# EAGLE design ECE445_Interrogator_Schematic (EAGLE 7.5.0)
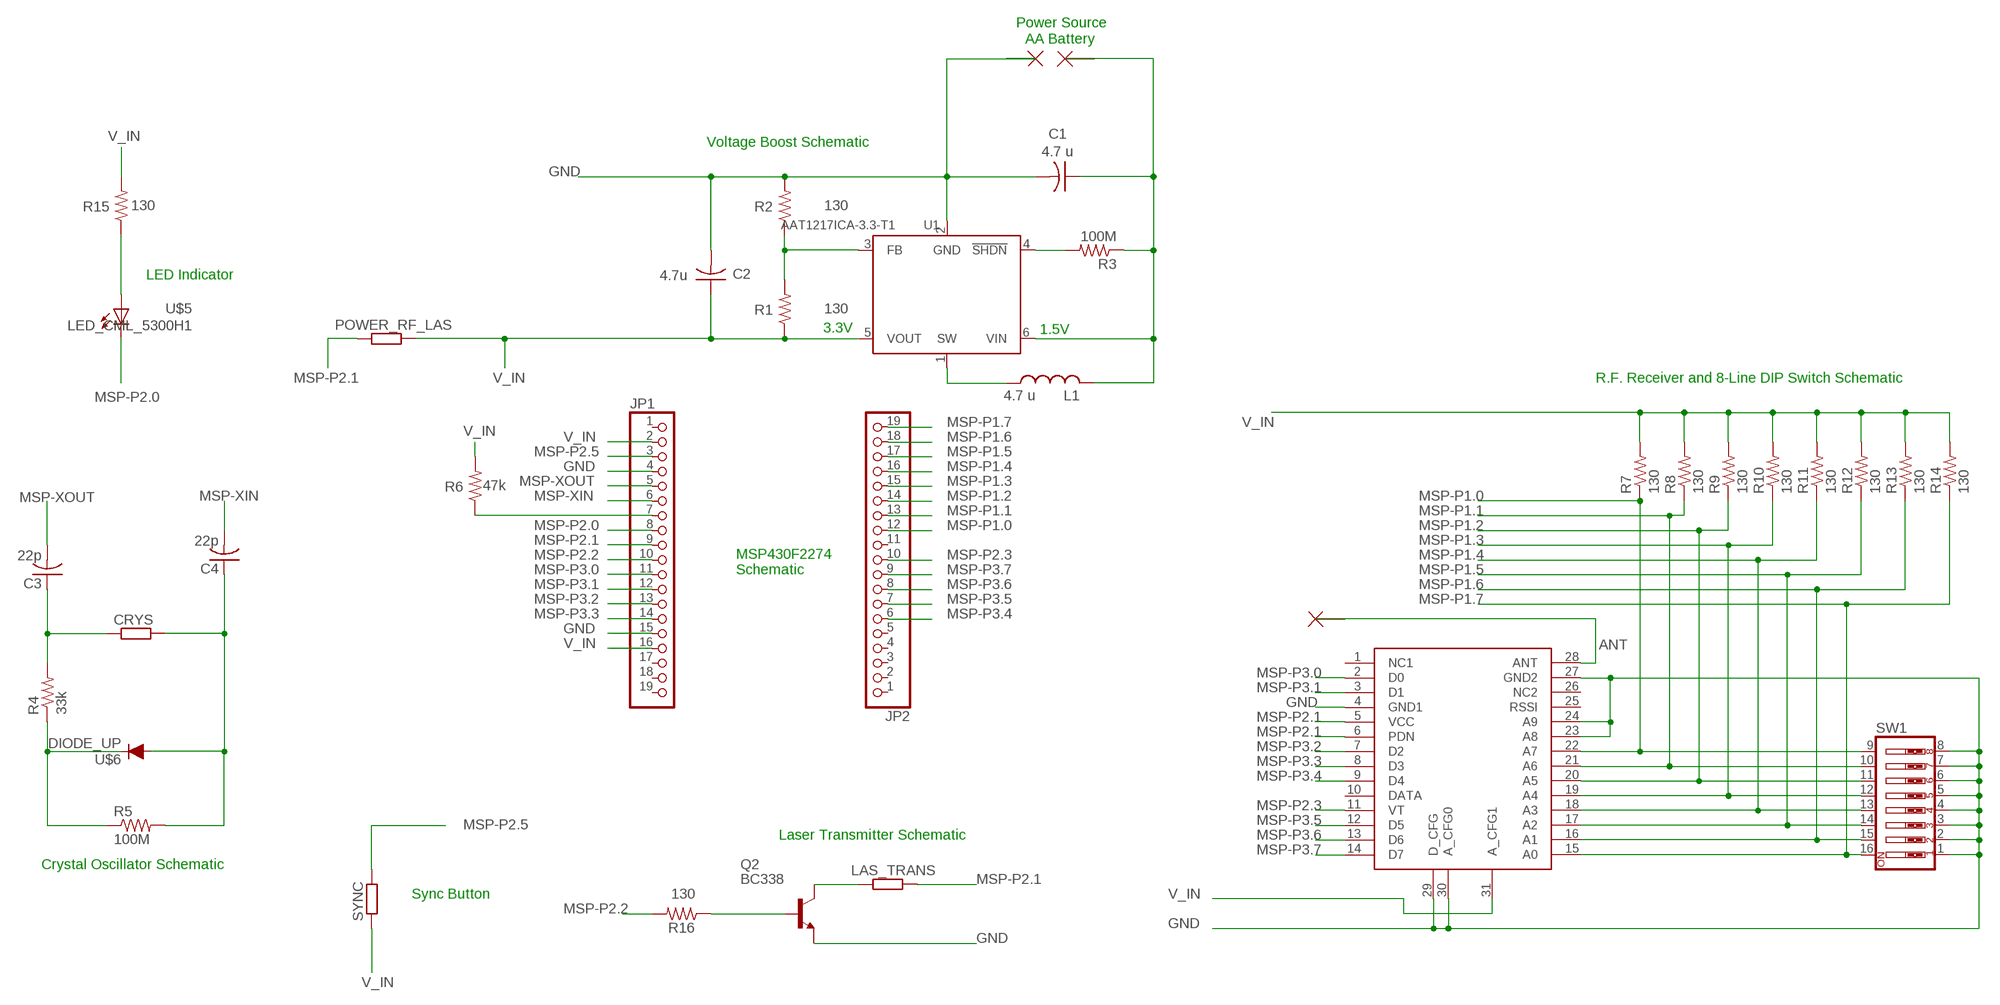
[diagram p0: schematic, sheet 1]

## Parts
C1  4.7 u  C-US025-024X044  [C025-024X044]
C2  4.7u  C-US025-024X044  [C025-024X044]
C3  22p  C-US025-024X044  [C025-024X044]
C4  22p  C-US025-024X044  [C025-024X044]
CRYS  R-EU_0204/5  [0204/5]
JP1  PINHD-1X19  [1X19]
JP2  PINHD-1X19  [1X19]
L1  4.7 u  L-US0204/5  [0204/5]
LAS_TRANS  R-EU_0204/5  [0204/5]
POWER_RF_LAS  R-EU_0204/5  [0204/5]
Q2  BC338  [TO92-EBC]
R1  130  R-US_0204/5  [0204/5]
R2  130  R-US_0204/5  [0204/5]
R3  100M  R-US_0204/2V  [0204V]
R4  33k  R-US_0204/2V  [0204V]
R5  100M  R-US_0204/2V  [0204V]
R6  47k  R-US_0204/5  [0204/5]
R7  130  R-US_0204/5  [0204/5]
R8  130  R-US_0204/5  [0204/5]
R9  130  R-US_0204/5  [0204/5]
R10  130  R-US_0204/5  [0204/5]
R11  130  R-US_0204/5  [0204/5]
R12  130  R-US_0204/5  [0204/5]
R13  130  R-US_0204/5  [0204/5]
R14  130  R-US_0204/5  [0204/5]
R15  130  R-US_0204/5  [0204/5]
R16  130  R-US_0204/5  [0204/5]
SW1  SW_DIP-8  [EDG-08]
SYNC  R-EU_0204/5  [0204/5]
U1  AAT1217ICA-3.3-T1  [TSOT-23-6]
U$1  KH3-RXM-LINX-315  [KH3-RXM-LINX-315]
U$2  NO_CONNECT  [NO_CONNECT]
U$3  NO_CONNECT  [NO_CONNECT]
U$4  NO_CONNECT  [NO_CONNECT]
U$5  LED_CML_5300H1  [LED_CML_5300H1]
U$6  DIODE_UP  [DIODEUP]

## Nets
ANT: U$1.28(ANT) U$4.P$1(NC)
GND: C1.2 C2.2 JP1.4 JP1.15 Q2.E R2.2 SW1.1 SW1.2 SW1.3 SW1.4 SW1.5 SW1.6 SW1.7 SW1.8 U1.2(GND) U$1.4(GND1) U$1.23(A8) U$1.24(A9) U$1.27(GND2) U$1.29(D_CFG) U$1.30(A_CFG0) U$2.P$1(NC)
MSP-P1.0: JP2.12 R7.1 SW1.9 U$1.22(A7)
MSP-P1.1: JP2.13 R8.1 SW1.10 U$1.21(A6)
MSP-P1.2: JP2.14 R9.1 SW1.11 U$1.20(A5)
MSP-P1.3: JP2.15 R10.1 SW1.12 U$1.19(A4)
MSP-P1.4: JP2.16 R11.1 SW1.13 U$1.18(A3)
MSP-P1.5: JP2.17 R12.1 SW1.14 U$1.17(A2)
MSP-P1.6: JP2.18 R13.1 SW1.15 U$1.16(A1)
MSP-P1.7: JP2.19 R14.1 SW1.16 U$1.15(A0)
MSP-P2.0: JP1.8 U$5.P$2(C)
MSP-P2.1: JP1.9 LAS_TRANS.2 POWER_RF_LAS.1 U$1.5(VCC) U$1.6(PDN)
MSP-P2.2: JP1.10 R16.2
MSP-P2.3: JP2.10 U$1.11(VT)
MSP-P2.5: JP1.3 SYNC.2
MSP-P3.0: JP1.11 U$1.2(D0)
MSP-P3.1: JP1.12 U$1.3(D1)
MSP-P3.2: JP1.13 U$1.7(D2)
MSP-P3.3: JP1.14 U$1.8(D3)
MSP-P3.4: JP2.6 U$1.9(D4)
MSP-P3.5: JP2.7 U$1.12(D5)
MSP-P3.6: JP2.8 U$1.13(D6)
MSP-P3.7: JP2.9 U$1.14(D7)
MSP-XIN: C4.2 JP1.6
MSP-XOUT: C3.2 JP1.5
N$1: LAS_TRANS.1 Q2.C
N$2: L1.1 U1.1(SW)
N$4: C1.1 L1.2 R3.1 U1.6(VIN) U$3.P$1(NC)
N$6: C3.1 CRYS.1 R4.2
N$7: Q2.B R16.1
N$8: R4.1 R5.1 U$6.C
N$11: R1.2 R2.1 U1.3(FB)
N$12: C4.1 CRYS.2 R5.2 U$6.A
N$13: JP1.7 R6.1
N$19: R3.2 U1.4(!SHDN)
N$31: R15.1 U$5.P$1(A)
V_IN: C2.1 JP1.2 JP1.16 POWER_RF_LAS.2 R1.1 R6.2 R7.2 R8.2 R9.2 R10.2 R11.2 R12.2 R13.2 R14.2 R15.2 SYNC.1 U1.5(VOUT) U$1.31(A_CFG1)
Unconnected: JP1.1 JP1.17 JP1.18 JP1.19 JP2.1 JP2.2 JP2.3 JP2.4 JP2.5 JP2.11 U$1.1(NC1) U$1.10(DATA) U$1.25(RSSI) U$1.26(NC2)

## Notes on the sheet
- Power Source
- AA Battery
- Voltage Boost Schematic
- LED Indicator
- 3.3V | 1.5V
- R.F. Receiver and 8-Line DIP Switch Schematic
- MSP430F2274
  Schematic
- Laser Transmitter Schematic
- Crystal Oscillator Schematic
- Sync Button

## Library data of the parts
C1-C4 = rcl:C-US: CAPACITOR, American symbol
CRYS LAS_TRANS POWER_RF_LAS SYNC = rcl:R-EU_: RESISTOR, European symbol
JP1 JP2 = pinhead:PINHD-1X19: PIN HEADER
L1 = rcl:L-US: INDUCTOR, American symbol
Q2 = MarkSmartsPartsSpring2015:BC338*: NPN Transistor
R1-R16 = rcl:R-US_: RESISTOR, American symbol
SW1 = special:SW_DIP-8: DIP SWITCH
U1 = Skyworks:AAT1217
U$1 = KH3-RXM-LINX-315:KH3-RXM-LINX-315
U$2-U$4 = NO_CONNECT:NO_CONNECT
U$5 = MarkSmartsPartsSpring2015:LED_CML_5300H1
U$6 = MarkSmartsPartsSpring2015:DIODE_UP

## Board
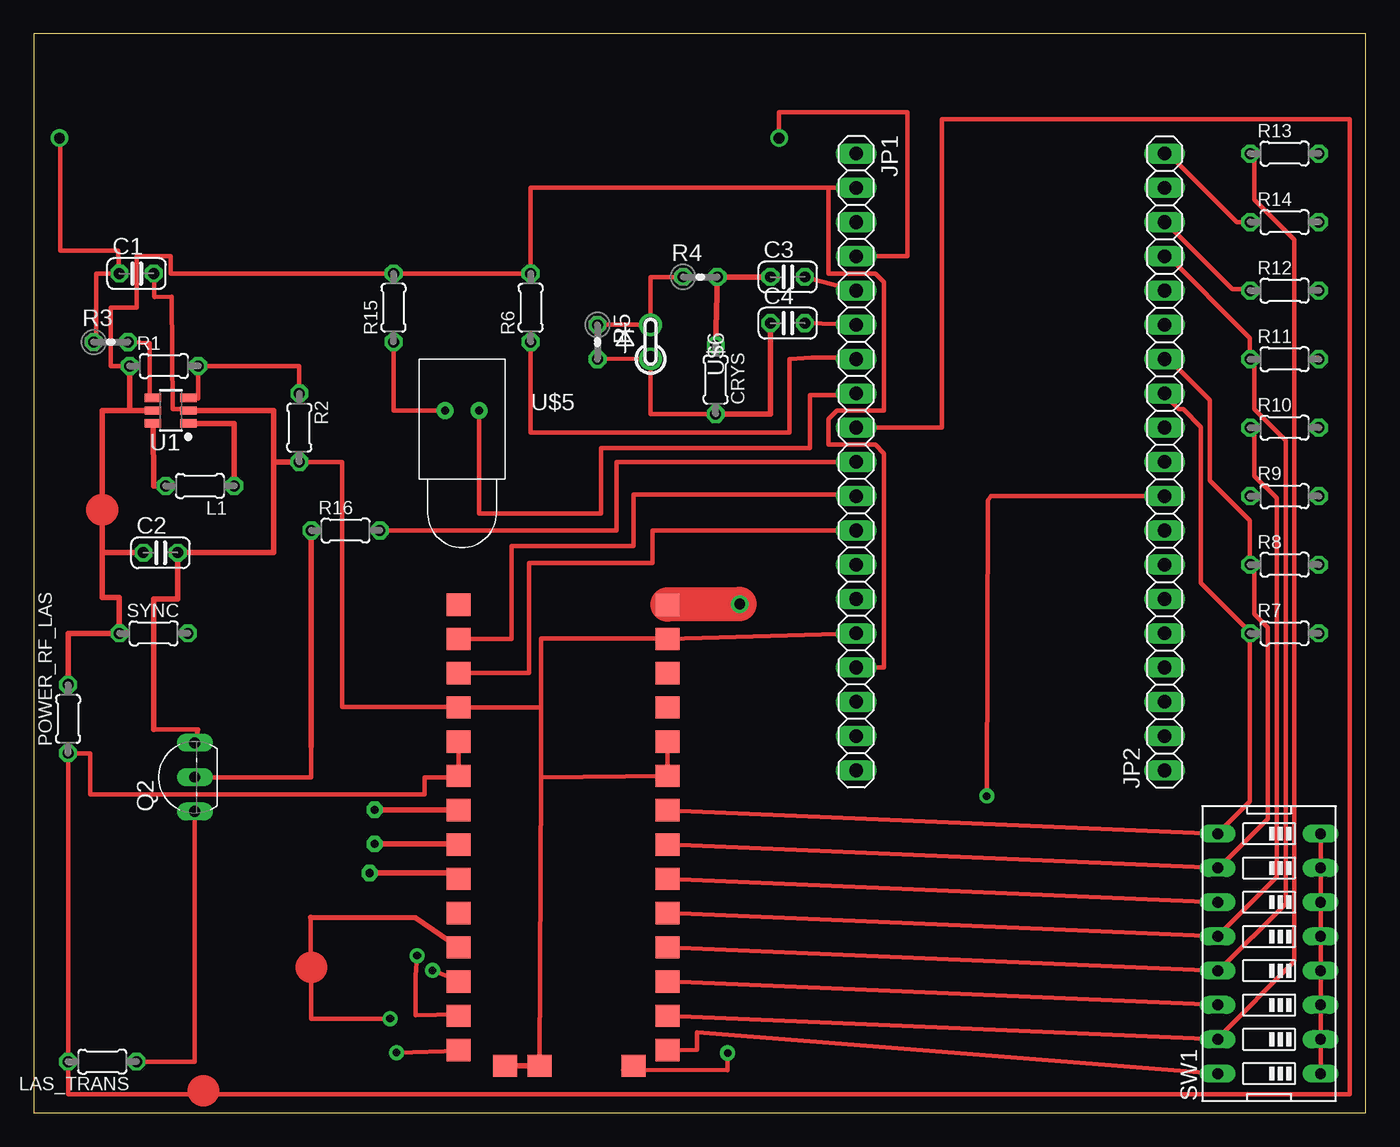
[diagram p1: board, top side]
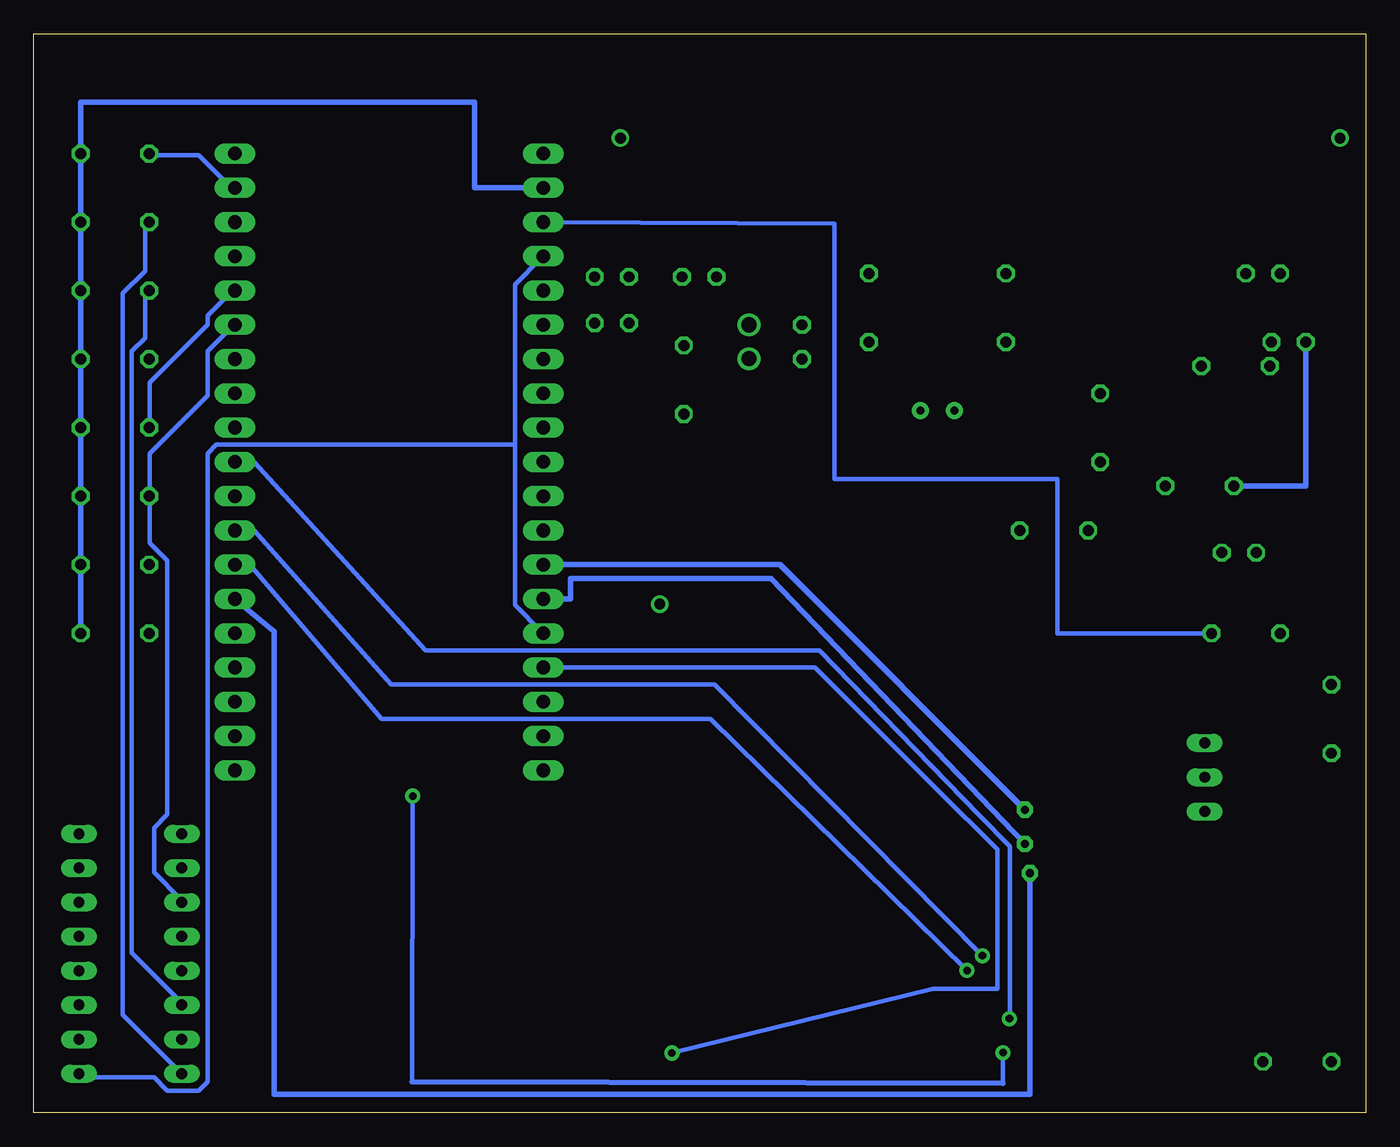
[diagram p2: board, bottom side, seen from below]

Size 98.73 x 80 mm. Coordinates in mm from the lower left corner, seen from the top.
Outline: 0,0 98.73,0 98.73,80 0,80 0,0
Copper layers (1*16): Top 0.035mm / dielectric 1.5mm / Bottom 0.035mm
Design rules "MWSEagleDesignRules2": minimum track width 13mil, minimum drill 22mil, track to track 13mil, track to pad 13mil, pad to pad 13mil, via to via 13mil, smd to smd 8mil, copper to edge 40mil, drill to drill 8mil, minimum pad ring 10mil, minimum via ring 8mil, stop-mask expansion 4mil, vias tented up to drill 0mil, thermal gap 10mil

### Footprints (pad centres in the part's own frame; a part is rotated, then mirrored left to right if it is on the bottom)
C025-024X044 = drill 0.813 octagon: 1 -1.27,0; 2 1.27,0
0204/5 = drill 0.813 octagon: 1 -2.54,0; 2 2.54,0
1X19 = drill 1.016 long: 1 -22.86,0; 2 -20.32,0; 3 -17.78,0; 4 -15.24,0; 5 -12.7,0; 6 -10.16,0; 7 -7.62,0; 8 -5.08,0; 9 -2.54,0; 10 0,0; 11 2.54,0; 12 5.08,0; 13 7.62,0; 14 10.16,0; 15 12.7,0; 16 15.24,0; 17 17.78,0; 18 20.32,0; 19 22.86,0
TO92-EBC = drill 0.813 long: B 0,-1.27; C -2.54,-1.27; E 2.54,-1.27
0204V = drill 0.813 octagon: 1 -1.27,0; 2 1.27,0
EDG-08 = drill 0.813 long: 1 -8.89,-3.81; 2 -6.35,-3.81; 3 -3.81,-3.81; 4 -1.27,-3.81; 5 1.27,-3.81; 6 3.81,-3.81; 7 6.35,-3.81; 8 8.89,-3.81; 9 8.89,3.81; 10 6.35,3.81; 11 3.81,3.81; 12 1.27,3.81; 13 -1.27,3.81; 14 -3.81,3.81; 15 -6.35,3.81; 16 -8.89,3.81
TSOT-23-6 = smd 1.22 x 0.62: 1 -1.31,0.95; 2 -1.31,0; 3 -1.31,-0.95; 4 1.31,-0.95; 5 1.31,0; 6 1.31,0.95
KH3-RXM-LINX-315 = smd 1.78 x 1.65: 1 -8,19.52; 2 -8,16.98; 3 -8,14.44; 4 -8,11.9; 5 -8,9.36; 6 -8,6.82; 7 -8,4.28; 8 -8,1.74; 9 -8,-0.8; 10 -8,-3.34; 11 -8,-5.88; 12 -8,-8.42; 13 -8,-10.96; 14 -8,-13.5; 15 7.49,-13.5; 16 7.49,-10.96; 17 7.49,-8.42; 18 7.49,-5.88; 19 7.49,-3.34; 20 7.49,-0.8; 21 7.49,1.74; 22 7.49,4.28; 23 7.49,6.82; 24 7.49,9.36; 25 7.49,11.9; 26 7.49,14.44; 27 7.49,16.98; 28 7.49,19.52; 29 -4.55,-14.67; 30 -2.01,-14.67; 31 4.95,-14.67
NO_CONNECT = drill 0.8: P$1 0,0
LED_CML_5300H1 = drill 0.6 pad 1.27: P$1 -1.27,5.08; P$2 1.27,5.08
DIODEUP = drill 1.118: A -2.565,0; C -5.08,0

### Placement (x,y rotation side)
C1  7.62,62.23 0 top
C2  9.4,41.53 0 top
C3  55.88,61.98 0 top
C4  55.88,58.55 0 top
CRYS  50.55,54.36 270 top
JP1  60.96,48.26 270 top
JP2  83.82,48.26 90 top
L1  12.32,46.48 180 top
LAS_TRANS  5.08,3.81 180 top
POWER_RF_LAS  2.54,29.21 90 top
Q2  10.67,24.89 90 top
R1  9.65,55.37 0 top
R2  19.68,50.8 270 top
R3  5.71,57.15 0 top
R4  49.4,61.98 0 top
R5  41.78,57.15 270 top
R6  36.83,59.69 90 top
R7  92.71,35.56 0 top
R8  92.71,40.64 0 top
R9  92.71,45.72 0 top
R10  92.71,50.8 0 top
R11  92.71,55.88 0 top
R12  92.71,60.96 0 top
R13  92.71,71.12 0 top
R14  92.71,66.04 0 top
R15  26.67,59.69 90 top
R16  23.11,43.18 0 top
SW1  91.57,11.81 90 top
SYNC  8.89,35.56 0 top
U1  10.16,52.07 180 top
U$1  39.5,18.16 0 top
U$2  55.24,72.26 0 top
U$3  1.91,72.26 0 top
U$4  52.32,37.72 0 top
U$5  31.75,46.99 0 top
U$6  45.72,53.34 270 top

### Tracks (layer width: path | path; a pad name or v marks a point on that pad's centre or on a via)
ANT
  Top 2.54: U$1.28 U$4.P$1
GND
  Top 0.33: C1.2 8.91,62.08 8.91,60.53 8.97,60.48 10.24,60.5 10.31,52.17 11.23,52.17 U1.2 | SW1.8 SW1.7 SW1.6 SW1.5 SW1.4 SW1.3 SW1.2 SW1.1 | U$2.P$1 55.24,74.17 64.77,74.17 64.77,63.5 JP1.4 | U$1.24 U$1.23 37.59,24.89 | JP1.15 U$1.27 46.99,35.18 37.59,35.18 37.59,30.06 | U$1.30 37.59,24.89 | 37.59,30.06 U$1.4 31.5,30.1 22.86,30.1 22.86,48.26 R2.2 | 37.59,24.89 37.59,30.06 | 8.89,28.45 12.19,28.45 Q2.E
  Top 0.406: U$1.29 U$1.30 | 8.89,28.45 8.89,38.1 10.67,38.1 C2.2 17.78,41.53 17.78,48.26 | 17.78,48.26 R2.2 | U1.2 17.78,52.07 17.78,48.26
  Bottom 0.33: 63.07,49.53 63.07,37.64 61.09,35.66 JP1.15 | 63.07,49.53 63.07,61.42 61.09,63.4 JP1.4 | 63.07,49.53 85.19,49.53 85.85,48.87 85.85,2.31 86.51,1.65 88.82,1.65 89.81,2.64 95.1,2.64 SW1.1
MSP-P1.0
  Top 0.33: U$1.22 SW1.9 87.83,20.8 90.14,23.11 90.14,35.33 R7.1 90.14,35.66 86.51,39.29 86.51,50.85 85.19,52.17 84.86,52.17 83.87,53.16 JP2.12
MSP-P1.1
  Top 0.33: U$1.21 SW1.10 87.83,18.16 91.47,21.79 91.47,35.99 90.47,36.98 90.47,40.62 R8.1 90.14,40.95 90.14,43.92 87.17,46.89 87.17,52.83 83.87,56.13 JP2.13
MSP-P1.2
  Top 0.33: U$1.20 SW1.11
  Bottom 0.33: JP2.14 83.87,58.45 85.85,56.46 85.85,53.16 90.14,48.87 90.14,45.9 R9.1 90.14,45.57 90.14,42.27 88.82,40.95 88.82,22.12 89.81,21.13 89.81,17.83 87.83,15.85 SW1.11
MSP-P1.3
  Top 0.33: U$1.19 SW1.12 87.83,13.21 92.13,17.5 92.13,45.57 90.47,47.22 90.47,50.52 R10.1
  Bottom 0.33: R10.1 90.14,50.85 90.14,54.15 85.85,58.45 85.85,59.11 83.87,61.09 JP2.15
MSP-P1.4
  Top 0.33: U$1.18 SW1.13 87.83,10.57 92.79,15.52 92.79,49.86 90.47,52.17 90.47,55.8 R11.1 90.14,56.13 90.14,57.45 83.87,63.73 JP2.16
MSP-P1.5
  Top 0.33: U$1.17 SW1.14 | R12.1 90.14,61.09 88.82,61.09 83.87,66.04 JP2.17
  Bottom 0.33: R12.1 90.47,60.76 90.47,57.45 91.47,56.46 91.47,11.89 87.83,8.26 SW1.14
MSP-P1.6
  Top 0.33: U$1.16 SW1.15 87.83,5.61 93.45,11.23 93.45,64.72 90.47,67.69 90.47,70.99 R13.1
  Bottom 0.33: R13.1 90.14,70.99 86.51,70.99 83.87,68.35 JP2.18
MSP-P1.7
  Top 0.33: R14.1 89.15,66.04 83.87,71.32 JP2.19 | U$1.15 49.15,4.7 49.15,5.97 SW1.16
  Bottom 0.33: R14.1 90.47,66.04 90.47,62.41 92.13,60.76 92.13,7.26 87.83,2.97 SW1.16
MSP-P2.0
  Top 0.33: JP1.8 60.96,53.21 57.53,53.21 57.53,49.28 42.04,49.28 42.04,45.47 42.04,44.96 42.04,44.45 33.02,44.45 U$5.P$2
MSP-P2.1
  Top 0.33: U$1.5 U$1.6 31.5,24.89 28.96,24.89 28.96,23.62 4.19,23.62 4.19,26.67 POWER_RF_LAS.1 LAS_TRANS.2 2.54,1.4 97.54,1.4 97.54,73.66 67.31,73.66 67.31,50.8 JP1.9
MSP-P2.2
  Top 0.33: R16.2 43.18,43.18 43.18,48.26 JP1.10
MSP-P2.3  (via drill 0.56)
  Top 0.33: 20.54,14.51 20.57,6.99 v26.42,6.99
  Top 0.406: 20.54,14.51 28.32,14.48 U$1.11
  Bottom 0.33: v26.42,6.99 26.38,7.02 26.38,19.78 28.64,22.07 40.48,34.29 69.69,34.29 82.39,48.26 JP2.10
MSP-P2.5
  Bottom 0.33: SYNC.2 22.86,35.56 22.86,46.99 39.37,46.99 39.37,65.91 JP1.3
MSP-P3.0
  Top 0.33: U$1.2 35.43,35.14 35.43,42.04 44.45,42.04 44.45,45.85 60.96,45.85 JP1.11
MSP-P3.1
  Top 0.33: U$1.3 36.7,32.6 36.7,40.77 45.85,40.77 45.85,43.18 JP1.12
MSP-P3.2  (via drill 0.6)
  Top 0.406: U$1.7 31.46,22.48 v25.27,22.48
  Bottom 0.406: v25.27,22.48 43.43,40.64 JP1.13
MSP-P3.3  (via drill 0.6)
  Top 0.406: U$1.8 31.46,19.94 v25.27,19.94
  Bottom 0.406: v25.27,19.94 44.07,39.62 58.93,39.62 58.93,38.1 JP1.14
MSP-P3.4  (via drill 0.6)
  Top 0.406: U$1.9 31.75,17.78 v24.89,17.78
  Bottom 0.406: v24.89,17.78 24.89,1.4 80.9,1.4 80.9,35.69 JP2.6
MSP-P3.5  (via drill 0.56)
  Top 0.33: v29.56,10.57 31.43,9.84 U$1.12
  Bottom 0.33: v29.56,10.57 48.58,29.21 72.93,29.21 82.71,40.64 JP2.7
MSP-P3.6  (via drill 0.56)
  Top 0.33: v28.42,11.65 28.32,10.16 28.32,7.24 31.43,7.3 U$1.13
  Bottom 0.33: v28.42,11.65 48.26,31.75 72.23,31.75 82.39,43.18 JP2.8
MSP-P3.7  (via drill 0.56)
  Top 0.33: v26.89,4.48 31.59,4.6 U$1.14 | v70.64,23.5 70.71,45.4 70.96,45.72 JP2.9
  Bottom 0.33: 26.89,2.19 v26.89,4.48 | v70.64,23.5 70.67,2.32
  Bottom 0.406: 26.89,2.19 70.67,2.32
MSP-XIN
  Top 0.33: C4.2 JP1.6
MSP-XOUT
  Top 0.33: C3.2 JP1.5
N$1
  Top 0.33: LAS_TRANS.1 11.94,3.81 Q2.C
N$2
  Top 0.406: U1.1 14.86,51.12 L1.1
N$4
  Top 0.33: U$3.P$1 1.98,71.98 1.98,63.91 6.27,63.93 C1.1 4.62,62.2 4.62,57.45 R3.1
  Top 0.406: U1.6 8.89,46.48 L1.2
  Bottom 0.406: R3.1 4.45,46.48 L1.2
N$6
  Top 0.406: C3.1 R4.2 CRYS.1
N$7
  Top 0.33: Q2.B 20.57,24.89 20.57,27.18
  Top 0.406: 20.57,27.18 R16.1
N$8
  Top 0.33: R4.1 45.72,61.98 U$6.C R5.1
N$11
  Top 0.33: U1.3 12.19,52.96 R1.2 19.68,55.37 R2.1
N$12
  Top 0.33: CRYS.2 45.72,51.82 U$6.A R5.2
  Top 0.406: CRYS.2 54.61,51.82 C4.1
N$13
  Top 0.33: R6.1 36.83,50.42 56.01,50.42 56.01,55.88 57.66,56.01 60.96,56.01 JP1.7
N$19
  Top 0.33: U1.4 8.59,53.16 8.59,57.07 7.26,57.12 R3.2
N$31
  Top 0.33: U$5.P$1 26.67,52.07 R15.1
V_IN  (via drill 0.56)
  Top 0.33: R1.1 5.71,55.37 5.71,59.69 7.62,59.69 7.62,63.5 10.16,63.5 10.16,62.23 R15.2 R6.2 36.83,68.58 58.9,68.58 | 58.9,68.58 JP1.2 | U$1.31 44.29,3.33 43.69,3.21 51.44,3.17 v51.44,4.45 | JP1.16 63.02,33.02 63.02,48.9 62.39,49.53 58.9,49.53 58.9,51.44 59.53,52.07 63.02,52.07 63.02,61.59 62.39,62.23 58.9,62.23 58.9,68.58
  Top 0.406: POWER_RF_LAS.2 2.54,35.56 SYNC.1 6.35,38.23 5.08,38.23 5.08,41.53 | U1.5 7.11,52.07 | 7.11,52.07 5.08,52.07 5.08,41.53 | 5.08,41.53 C2.1 | R1.1 7.11,52.07
  Bottom 0.33: v51.44,4.45 32.07,9.21 27.3,9.21 27.3,19.53 31.78,23.97 40.83,33.02 JP1.16
  Bottom 0.406: JP1.2 66.04,68.58 66.04,74.93 95.25,74.93 R13.2 R14.2 R12.2 R11.2 R10.2 R9.2 R8.2 R7.2
(copper drawn outside any net)
  shapes: Top circle x3

### Text on the board
Document: V_S+ | V_S- | Test Voltage-In | Test Valid Transmission | Test Laser
tDocu: Alkaline AA Battery